# Altium schematic sheet 2001A.SchDoc
size A4
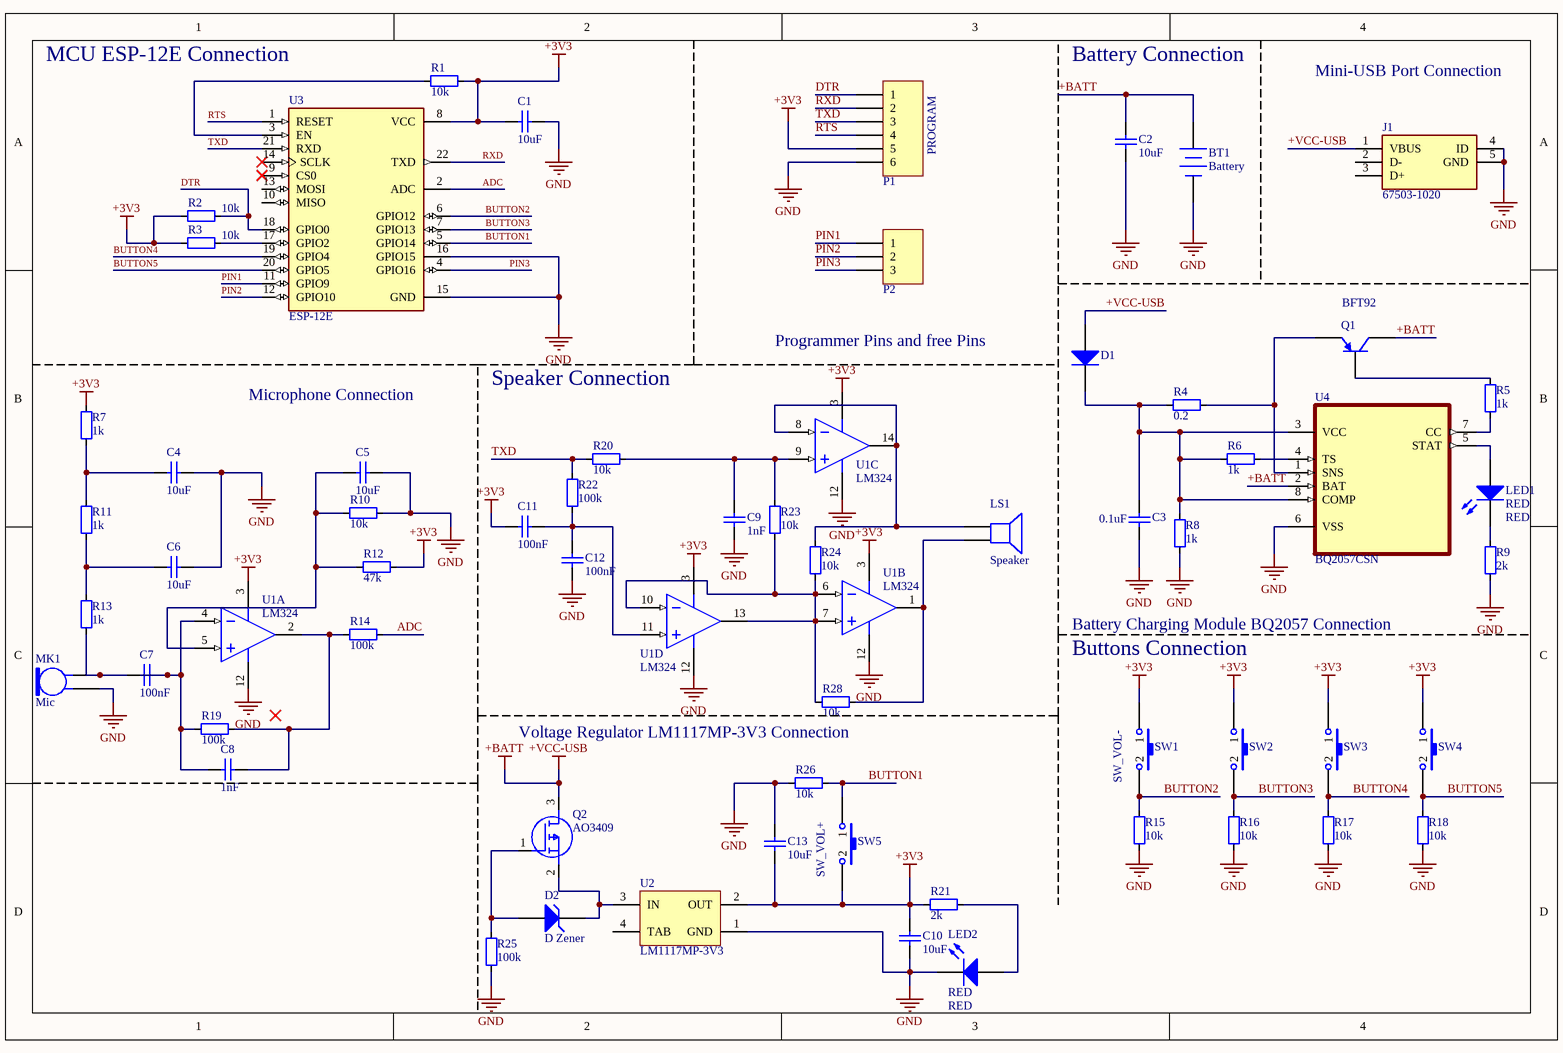
[diagram p0: 2001A.SchDoc]

## Parts
BT1  Battery  [BAT-2]
C1  value 10uF  [0603_CAP]  (hidden comment: Cap)
C2  value 10uF  [0603_CAP]  (hidden comment: Cap)
C3  value 0.1uF  [0603_CAP]  (hidden comment: Cap)
C4  value 10uF  [0603_CAP]  (hidden comment: Cap)
C5  value 10uF  [0603_CAP]  (hidden comment: Cap)
C6  value 10uF  [0603_CAP]  (hidden comment: Cap)
C7  value 100nF  [0603_CAP]  (hidden comment: Cap)
C8  value 1nF  [0603_CAP]  (hidden comment: Cap)
C9  value 1nF  [0603_CAP]  (hidden comment: Cap)
C10  value 10uF  [0603_CAP]  (hidden comment: Cap)
C11  value 100nF  [0603_CAP]  (hidden comment: Cap)
C12  value 100nF  [0603_CAP]  (hidden comment: Cap)
C13  value 10uF  [0603_CAP]  (hidden comment: Cap)
D1  (no value)  [0805_DIODE]
D2  D Zener  [*SOD-123_2_BZT52C4V7(Primary)]
ESP-12E  U3  [XCVR_ESP8266-12E/ESP-12E]
J1  67503-1020  [67503-1020]
LED1  RED  [LED_THT_RED]
LED2  RED  [0603]
LS1  Speaker  [PIN2]
MK1  Mic  [PIN2]
P1  PROGRAM  [HDR1X6]
P2  HDR1X3  [HDR1X3]  (value not drawn)
Q1  BFT92  [SOT23-3]
Q2  AO3409  [SOT95P237X112-3N]
R1  10k  [0603]
R2  10k  [0603]
R3  10k  [0603]
R4  0.2  [0805]
R5  1k  [0603]
R6  1k  [0603]
R7  1k  [0603]
R8  1k  [0603]
R9  2k  [0603]
R10  10k  [0603]
R11  1k  [0603]
R12  47k  [0603]
R13  1k  [0603]
R14  100k  [0603]
R15  10k  [0603]
R16  10k  [0603]
R17  10k  [0603]
R18  10k  [0603]
R19  100k  [0603]
R20  10k  [0603]
R21  2k  [0603]
R22  100k  [0603]
R23  10k  [0603]
R24  10k  [0603]
R25  100k  [0603]
R26  10k  [0603]
R28  10k  [0603]
SW1  SW_VOL-  [Micro_Switch]
SW2  SW_VOL-  [Micro_Switch]  (value not drawn)
SW3  SW_VOL-  [Micro_Switch]  (value not drawn)
SW4  SW_VOL-  [Micro_Switch]  (value not drawn)
SW5  SW_VOL+  [Micro_Switch]
U1  LM324  [SOIC14]  (parts A,B,C,D of 4)
U2  LM1117MP-3V3  [SOT223]
U4  BQ2057CSN  [SOIC127P600X175-14N]

## Nets
+3V3: C1.1 C10.2 C11.1 C13.1 ESP-12E.8(VCC) P1.5 R1.2 R2.1 R3.1 R7.1 R12.2 R21.2 SW1.1 SW2.1 SW3.1 SW4.1 SW5.2 U1.3(V+) U2.2(OUT)
+BATT: BT1.1(+) C2.2 D1.1(A) J1.1(VBUS) Q1.3(C) Q2.3(D) U4.2(BAT)  [also labelled +VCC-USB]
GND: BT1.2(-) C1.2 C2.1 C3.1 C4.2 C5.2 C6.2 C9.1 C10.1 C12.1 C13.2 ESP-12E.15(GND) ESP-12E.16(GPIO15) J1.4(ID) J1.5(GND) LED2.2(K) MK1.1 P1.6 R8.2 R9.2 R10.2 R15.2 R16.2 R17.2 R18.2 R25.2 R26.2 U1.12(GND) U2.1(GND) U4.6(VSS)
ADC: ESP-12E.2(ADC) R14.2
BUTTON1: ESP-12E.5(GPIO14) R26.1 SW5.1
BUTTON2: ESP-12E.6(GPIO12) R15.1 SW1.2
BUTTON3: ESP-12E.7(GPIO13) R16.1 SW2.2
BUTTON4: ESP-12E.19(GPIO4) R17.1 SW3.2
BUTTON5: ESP-12E.20(GPIO5) R18.1 SW4.2
DTR: ESP-12E.18(GPIO0) P1.1 R2.2
PIN1: ESP-12E.11(GPIO9) P2.1
PIN2: ESP-12E.12(GPIO10) P2.2
PIN3: ESP-12E.4(GPIO16) P2.3
RTS: ESP-12E.1(RESET) P1.4
RXD: ESP-12E.22(TXD) P1.2
TXD: ESP-12E.21(RXD) P1.3 R20.1 R22.2
NetC3_2: C3.2 D1.2(K) R4.1 R6.1 R8.1 U4.3(VCC) U4.8(COMP)
NetC4_1: C4.1 R7.2 R11.1
NetC5_1: C5.1 R10.1 R12.1 U1.5(IN+)
NetC6_1: C6.1 R11.2 R13.1
NetC7_1: C7.1 MK1.2 R13.2
NetC7_2: C7.2 C8.1 R19.1 U1.4(IN-)
NetC8_2: C8.2 R14.1 R19.2 U1.2(OUT)
NetC9_2: C9.2 R20.2 R23.2 U1.9(IN+)
NetC11_2: C11.2 C12.2 R22.1 U1.11(IN+)
NetD2_1: D2.1(A) Q2.1(G) R25.1
NetD2_2: D2.2(K) Q2.2(S) U2.3(IN)
NetESP-12E_3: ESP-12E.3(EN) R1.1
NetESP-12E_17: ESP-12E.17(GPIO2) R3.2
NetLED1_1: LED1.1(A) U4.5(STAT)
NetLED1_2: LED1.2(K) R9.1
NetLED2_1: LED2.1(A) R21.1
NetLS1_1: LS1.1 R24.2 U1.8(IN-) U1.14(OUT)
NetLS1_2: LS1.2 R28.2 U1.1(OUT)
NetQ1_1: Q1.1(E) R4.2 U4.1(SNS)
NetQ1_2: Q1.2(B) R5.1
NetR5_2: R5.2 U4.7(CC)
NetR6_2: R6.2 U4.4(TS)
NetR23_1: R23.1 R24.1 R28.1 U1.6(IN-) U1.7(IN+) U1.10(IN-) U1.13(OUT)

Not connected (* = marked no-connect by the designer): ESP-12E 9(CS0)* 10(MISO) 13(MOSI) 14(SCLK)*; J1 2(D-) 3(D+); U2 4(TAB)

## Notes on the sheet
- MCU ESP-12E Connection
- Battery Connection
- Mini-USB Port Connection
- Speaker Connection
- Programmer Pins and free Pins
- Microphone Connection
- Battery Charging Module BQ2057 Connection
- Buttons Connection
- (near R28) Voltage Regulator LM1117MP-3V3 Connection

## Library data of the parts
BT1 = Battery: Multicell Battery; Published: 24-Mar-1999; LatestRevisionDate: 17-Jul-2002; LatestRevisionNote: Re-released for DXP Platform.; PackageReference: BAT-2; Publisher: Altium Limited; PackageDescription: Battery; 2 Leads
C1-C13 = Cap: Ceramic capacitor; Unit Price1: *; Unit Price2: *
D1 = 1N4148: High-speed diode
D2 = D Zener: Zener Diode; Published: 8-Jun-2000; LatestRevisionDate: 17-Jul-2002; LatestRevisionNote: Re-released for DXP Platform.; PackageReference: DIODE-0.7; Publisher: Altium Limited; PackageDescription: Diode, Thru-Hole; 2 Leads; 0.7 in Pin Spacing
ESP-12E = ESP8266-12E/ESP-12E: This WiFi module has a 32-bit MCU micro and clock speeds supporting 80 MHz or 160 MHz. Supports the RTOS and integrated Wi-Fi MAC/BB/RF/PA/LNA, and has an on-board antenna.; Value: U?; MF: AI-Thinker; Price: None; Package: None; MP: ESP8266-12E/ESP-12E; Availability: Unavailable; SnapEDA_Link: https://www.snapeda.com/parts/ESP8266-12E/ESP-12E/AI-Thinker/view-part/106414/?ref=snap
J1 = 67503-1020: Connector; Manufacturer_Name: Molex; Datasheet Link: http://docs-emea.rs-online.com/webdocs/13c4/0900766b813c46de.pdf; Manufacturer_Part_Number: 67503-1020; Mouser Part Number: 538-67503-1020; Mouser Price/Stock: https://www.mouser.com/Search/Refine.aspx?Keyword=538-67503-1020; RS Part Number: 1891440; RS Price/Stock: http://uk.rs-online.com/web/p/products/1891440
LED1 LED2 = LED: Light-emitting diode; COLOR: RED
LS1 = Speaker: Loudspeaker; Published: 24-Mar-1999; LatestRevisionDate: 17-Jul-2002; LatestRevisionNote: Re-released for DXP Platform.; PackageReference: PIN2; Publisher: Altium Limited
MK1 = Mic2: Microphone; Published: 24-Mar-1999; LatestRevisionDate: 17-Jul-2002; LatestRevisionNote: Re-released for DXP Platform.; PackageReference: PIN2; Publisher: Altium Limited
P1 = HDR1X6: Header, 6-Pin; LatestRevisionDate: 17-Jul-2002; LatestRevisionNote: Re-released for DXP Platform.; Publisher: Altium Limited
P2 = HDR1X3: Header, 3-Pin; LatestRevisionDate: 17-Jul-2002; LatestRevisionNote: Re-released for DXP Platform.; Publisher: Altium Limited
Q1 = 2N3906: PNP General Purpose Amplifier; Published: 8-Jun-2000; LatestRevisionDate: 15-Jan-2003; LatestRevisionNote: PCB Footprint 'BCY-W3/D4.7' replaced; DatasheetVersion: 1997; PackageVersion: Sep-1998; PackageReference: TO-92A; Publisher: Altium Limited; PackageDescription: TO, Flat Index; 3 In-Line, Axial Leads; Body Dia. 4.5mm; Leads 0.51 x 0.48 mm (max); ComponentLink1Description: Manufacturer Link; ComponentLink1URL: http://www.fairchildsemi.com/; ComponentLink2Description: Datasheet; ComponentLink2URL: http://www.fairchildsemi.com/ds/2N%2F2N3906.pdf
Q2 = FDN340P: MOSFET (P-Channel); Manufacturer_Name: ON Semiconductor; Datasheet Link: https://www.onsemi.com/pub/Collateral/FDN340P-D.PDF; Height: 1.12mm; Manufacturer_Part_Number: FDN340P; Mouser Part Number: 512-FDN340P; Mouser Price/Stock: https://www.mouser.co.uk/ProductDetail/ON-Semiconductor-Fairchild/FDN340P?qs=AMp2PTjoga9dhzFXRaqTZw%3D%3D; RS Part Number: 6710435P; RS Price/Stock: http://uk.rs-online.com/web/p/products/6710435P
R1-R26 R28 = RES: Resistior
  R1-R3 R10 R15-R18 R20 R23 R24 R26 R28: Value: 10k
  R4: Value: 0.2
  R5-R8 R11 R13: Value: 1k
  R9 R21: Value: 2k
  R12: Value: 47k
  R14 R19 R22 R25: Value: 100k
SW1-SW5 = Micro_Switch: Switch; Published: 24-Mar-1999; LatestRevisionDate: 17-Jul-2002; LatestRevisionNote: Re-released for DXP Platform.; PackageReference: SPST-2; Publisher: Altium Limited
U1 = LM339AD: Quad Single-Supply Comparator; Published: 17-Jul-2002; LatestRevisionDate: 13-Apr-2006; LatestRevisionNote: IPC-7351 Footprint Added.; DatasheetVersion: 1988; PackageVersion: 1991; PackageReference: 751A-02; Publisher: Altium Limited; PackageDescription: 14-Pin Small Outline Integrated Circuit 1.27 mm Pitch; Code_IPC: SOIC127P600-14; ComponentLink1Description: Manufacturer Link; ComponentLink1URL: http://www.onsemi.com/site/products/taxonomy/0,4438,133,00.html
U2 = LM1117MP-3V3: 800mA Low-Dropout Linear Regulator; PartNumber: LM1117MP-3.3; Manufacturer: National Semiconductor; CompType: LDO IC; PackageTopMarking: XYTT*N05A; PowerWise: N; Published: 4-Dec-2008; DatasheetVersion: Apr-2006; PackageVersion: revB, Apr-2003; PackageReference: MP04A; Publisher: Altium Limited; PackageDescription: Molded SOT-223, 6.50 x 3.56 x 1.6mm Body, 4 Lead, 2.3mm Pitch; RoHS: O; PinCount: 4; DigiKeyPartNumber: LM1117MP-3.3CT-ND; Code_JEDEC: TO-261-AA; Code_IPC: SOT223-4; ComponentLink1Description: LM1117 Datasheet; ComponentLink1URL: http://www.national.com/ds/LM/LM1117.pdf; ComponentLink2Description: LM1117 Web Page; ComponentLink2URL: http://www.national.com/pf/LM/LM1117.html; ComponentLink3Description: MP04A Package Page; ComponentLink3URL: http://www.national.com/packaging/folders/mp04a.html
U4 = BQ2057CSN: Charger IC Lithium Ion/Polymer 8-SOIC; MF: Texas Instruments; Price: None; Package: SOIC-8 Texas Instruments; Availability: Unavailable; SnapEDA_Link: https://www.snapeda.com/parts/BQ2057CSN/Texas%20Instruments/view-part/237203/?ref=snap; Value: *; MP: BQ2057CSN